# Altium schematic sheet PIO Isolation.SchDoc
size A; SheetNumber: 5; SheetTotal: 6
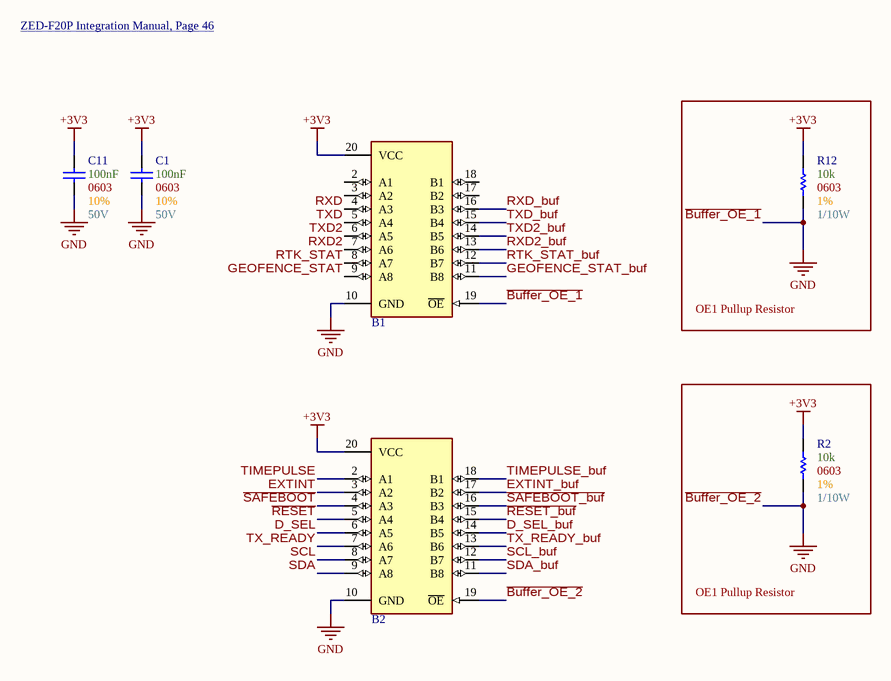
[diagram p0: PIO Isolation.SchDoc]

## Parts
B1  [Isolation Buffer] Bus Switch x8  [[Isolation Buffer] Bus Switch x8]  (value not drawn)
B2  [Isolation Buffer] Bus Switch x8  [[Isolation Buffer] Bus Switch x8]  (value not drawn)
C1  Max Voltage: 50V  Size Package: 0603  Tolerance: 10%  Capacitance: 100nF  [[Cap] SMD 0603]  (hidden comment: [Cap] 0603 0.1uF 10% 50V)
C11  Max Voltage: 50V  Size Package: 0603  Tolerance: 10%  Capacitance: 100nF  [[Cap] SMD 0603]  (hidden comment: [Cap] 0603 0.1uF 10% 50V)
R2  Wattage: 1/10W  Tolerance: 1%  Resistance: 10k  Size Package: 0603  [[Res] SMD 0603]  (hidden comment: [10k] SMD 0603 1% 1/8W)
R12  Wattage: 1/10W  Tolerance: 1%  Resistance: 10k  Size Package: 0603  [[Res] SMD 0603]  (hidden comment: [10k] SMD 0603 1% 1/8W)

## Blocks framed on the sheet
OE1 Pullup Resistor: R12
OE1 Pullup Resistor: R2

## Nets
+3V3: B1.20(VCC) B2.20(VCC) C1.2 C11.2 R2.2 R12.2
~{Buffer_OE_1}: B1.10(GND) B1.19(~{OE}) B2.10(GND) B2.19(~{OE}) C1.1 C11.1 R2.1 R12.1  [also labelled ~{Buffer_OE_2}, GND]
~{RESET}: B2.5(A4)
~{RESET_buf}: B2.15(B4)
~{SAFEBOOT}: B2.4(A3)
~{SAFEBOOT_buf}: B2.16(B3)
D_SEL: B2.6(A5)
D_SEL_buf: B2.14(B5)
EXTINT: B2.3(A2)
EXTINT_buf: B2.17(B2)
GEOFENCE_STAT: B1.9(A8)
GEOFENCE_STAT_buf: B1.11(B8)
RTK_STAT: B1.8(A7)
RTK_STAT_buf: B1.12(B7)
RXD: B1.4(A3)
RXD2: B1.7(A6)
RXD2_buf: B1.13(B6)
RXD_buf: B1.16(B3)
SCL: B2.8(A7)
SCL_buf: B2.12(B7)
SDA: B2.9(A8)
SDA_buf: B2.11(B8)
TIMEPULSE: B2.2(A1)
TIMEPULSE_buf: B2.18(B1)
TX_READY: B2.7(A6)
TX_READY_buf: B2.13(B6)
TXD: B1.5(A4)
TXD2: B1.6(A5)
TXD2_buf: B1.14(B5)
TXD_buf: B1.15(B4)

Not connected (* = marked no-connect by the designer): B1 2(A1) 3(A2) 17(B2) 18(B1)

## Notes on the sheet
- ZED-F20P Integration Manual, Page 46 <https://content.u-blox.com/sites/default/files/documents/ZED-F20P-00B_DataSheet_UBXDOC-304424225-18270.pdf#page=46>

## Library data of the parts
B1 B2 = [Isolation Buffer] Bus Switch x8: SN74CBTLV3245APWR; Supplier 1: DigiKey; Supplier Part Number 1: 296-9121-1-ND
C1 C11 = [Cap] 0603 0.1uF 10% 50V: CL10B104KB8NNNC; Supplier 1: DigiKey; Supplier Part Number 1: 1276-1000-6-ND
R2 R12 = [10k] SMD 0603 1% 1/8W: RMCF0603FT10K0; Supplier 1: DigiKey; Supplier Part Number 1: RMCF0603FT10K0DKR-ND